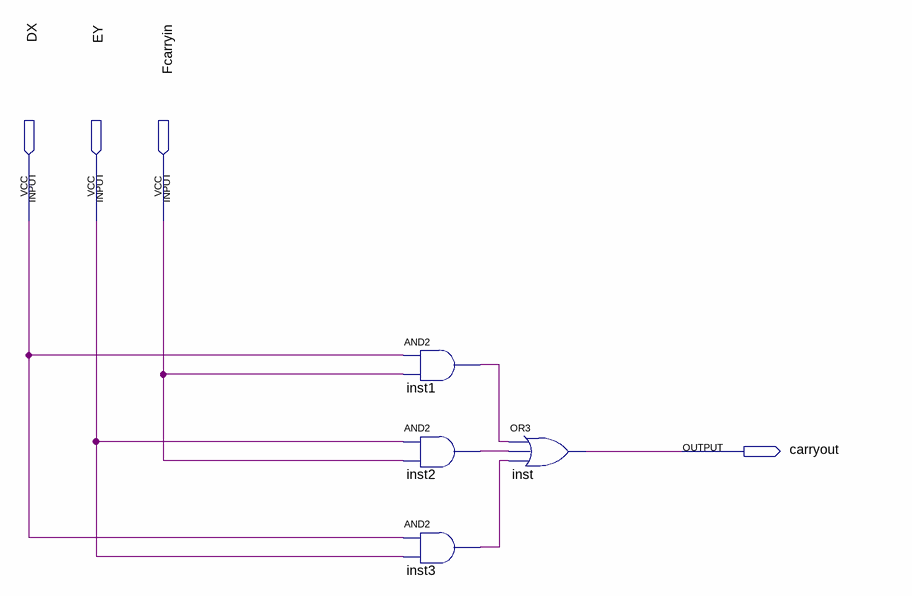
[diagram p0: schematic sheet]
// Quartus schematic carry_top.bdf as structural Verilog: 4 symbols, 4 pins
module carry_top (
  input  DX,
  input  EY,
  input  Fcarryin,
  output carryout
);

  wire inst1_out, inst2_out, inst3_out;

  and inst1 (inst1_out, DX, Fcarryin);
  and inst2 (inst2_out, EY, Fcarryin);
  and inst3 (inst3_out, DX, EY);
  or inst (carryout, inst1_out, inst2_out, inst3_out);
endmodule
